# Altium schematic sheet Sensor Ports.SchDoc
size A4
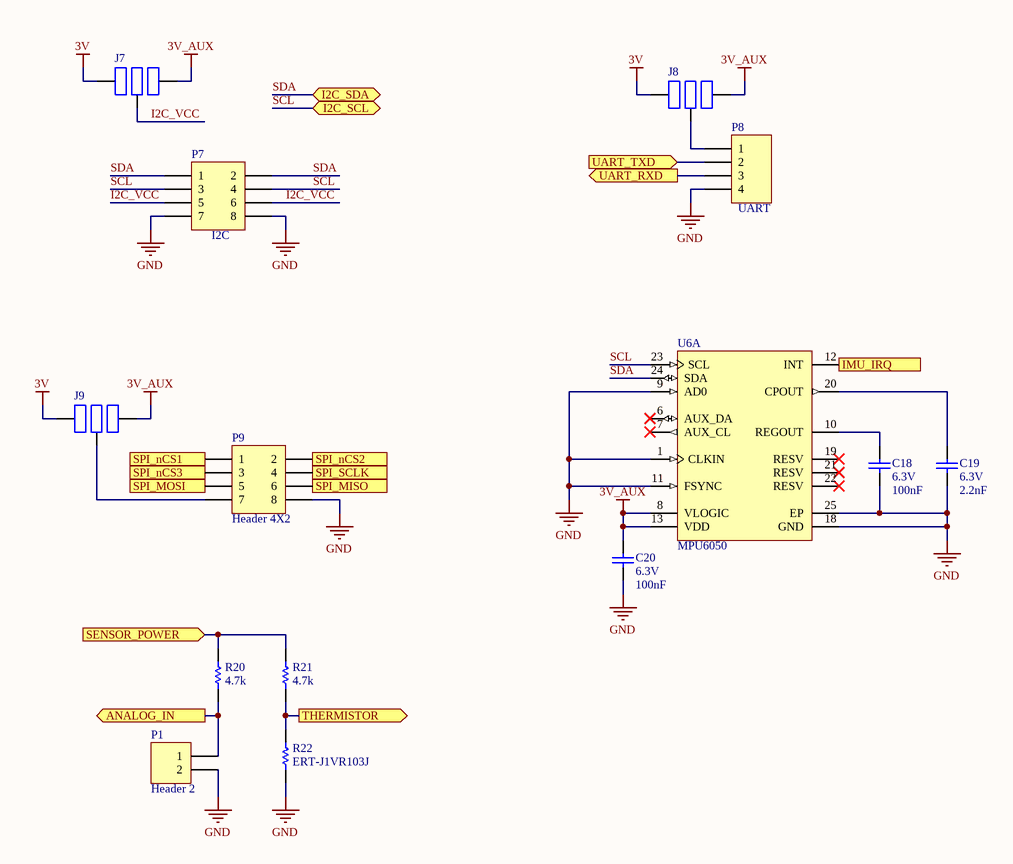
[diagram p0: Sensor Ports.SchDoc]

## Parts
C18  value 100nF  Voltage: 6.3V  [0603 (1608M)]  (hidden comment: Cap)
C19  value 2.2nF  Voltage: 6.3V  [0603 (1608M)]  (hidden comment: Cap)
C20  value 100nF  Voltage: 6.3V  [0603 (1608M)]  (hidden comment: Cap)
J7  3 Way Open Jumper  [Jumper-3 (Open)]  (value not drawn)  (no BOM)
J8  3 Way Open Jumper  [Jumper-3 (Open)]  (value not drawn)  (no BOM)
J9  3 Way Open Jumper  [Jumper-3 (Open)]  (value not drawn)  (no BOM)
P1  Header 2  [HDR1X2]
P7  I2C  [HDR2X4]
P8  UART  [HDR1X4]
P9  Header 4X2  [HDR2X4]
R20  value 4.7k  [0603 (1608M)]  (hidden comment: Resistor)
R21  value 4.7k  [0603 (1608M)]  (hidden comment: Resistor)
R22  ERT-J1VR103J  [RESC1608X90X30ML15T20]
U6  MPU6050  [INSE-QFN-24_V]  (part A of 2)

## Ports
ANALOG_IN (out), I2C_SCL (bidir), I2C_SDA (bidir), IMU_IRQ (out), SENSOR_POWER (in), SPI_MISO (out), SPI_MOSI (in), SPI_nCS1, SPI_nCS2, SPI_nCS3 (in), SPI_SCLK (in), THERMISTOR (out), UART_RXD (out), UART_TXD (in)

## Nets
3V: J7.1 J8.1 J9.1
3V_AUX: C20.2 J7.3 J8.3 J9.3 U6.8(VLOGIC) U6.13(VDD)
GND: C18.1 C19.1 C20.1 P1.2 P7.7 P7.8 P8.4 P9.8 R22.1 U6.1(CLKIN) U6.9(AD0) U6.11(FSYNC) U6.18(GND) U6.25(EP)
ANALOG_IN: P1.1 R20.1 ; port ANALOG_IN
I2C_VCC: J7.2 P7.5 P7.6
IMU_IRQ: U6.12(INT) ; port IMU_IRQ
SCL: P7.3 P7.4 U6.23(SCL) ; port I2C_SCL
SDA: P7.1 P7.2 U6.24(SDA) ; port I2C_SDA
SENSOR_POWER: R20.2 R21.2 ; port SENSOR_POWER
SPI_MISO: P9.6 ; port SPI_MISO
SPI_MOSI: P9.5 ; port SPI_MOSI
SPI_nCS1: P9.1 ; port SPI_nCS1
SPI_nCS2: P9.2 ; port SPI_nCS2
SPI_nCS3: P9.3 ; port SPI_nCS3
SPI_SCLK: P9.4 ; port SPI_SCLK
THERMISTOR: R21.1 R22.2 ; port THERMISTOR
UART_RXD: P8.3 ; port UART_RXD
UART_TXD: P8.2 ; port UART_TXD
NetC18_2: C18.2 U6.10(REGOUT)
NetC19_2: C19.2 U6.20(CPOUT)
NetJ8_2: J8.2 P8.1
NetJ9_2: J9.2 P9.7

Not connected (* = marked no-connect by the designer): U6 6(AUX_DA)* 7(AUX_CL)* 19(RESV)* 21(RESV)* 22(RESV)*

## Library data of the parts
C18-C20 = Cap: Capacitor
J7-J9 = Jumper-3 (Open)
P1 = Header 2: Header, 2-Pin; LatestRevisionDate: 17-Jul-2002; LatestRevisionNote: Re-released for DXP Platform.; Publisher: Altium Limited
P7 P9 = Header 4X2: Header, 4-Pin, Dual row; LatestRevisionDate: 17-Jul-2002; LatestRevisionNote: Re-released for DXP Platform.; Publisher: Altium Limited
P8 = Header 4: Header, 4-Pin; LatestRevisionDate: 17-Jul-2002; LatestRevisionNote: Re-released for DXP Platform.; Publisher: Altium Limited
R20 R21 = Resistor: Tolerance: 5%; Published: 8-Jun-2000; LatestRevisionDate: 17-Jul-2002; LatestRevisionNote: Re-released for DXP Platform.; PackageReference: AXIAL-0.3; Publisher: Altium Limited; PackageDescription: Axial Device, Thru-Hole; 2 Leads; 0.3 in Pin Spacing
R22 = CMP-2000-00869-1: Manufacturer: Panasonic; Part Number: ERT-J1VR103J
U6 = CMP-1753-00002-1: 3-Axis Gyroscope, 3-Axis Accelerometer / , 2.375 to 3.46 V, -40 to 105 degC, 24-Pin QFN, RoHS, Tape and Reel; Resistance: 5.6 kohm; Tolerance: 1%; Voltage Rating: 75 V; Power Rating: 100 mW; ComponentLink1Description: Manufacturer URL; Mount: Surface Mount; Max Operating Temperature: 155degC; Package Quantity: 5000; ComponentLink2Description: Datasheet; Pins: 2; Packaging: Tape and Reel; Case Code (Imperial): 0603; PackageReference: QFN-24; ComponentLink2URL: https://datasheet.ciiva.com/1513/1788002-1513632.pdf; Radiation Hardening: No; ComponentLink1URL: http://www.invensense.com/; PackageDescription: 24-Pin Quad Flat No-lead Package, Body 4 x 4 mm, Pitch 0.5 mm; Height: 0.45 mm; Case/Package: 0603; Case Code (Metric): 1608; REACH SVHC: Yes; Min Operating Temperature: -55degC; DatasheetVersion: Rev. 3.4, 08/2013; Width: 0.8 mm; RoHSCompliant: True; Length: 1.6 mm